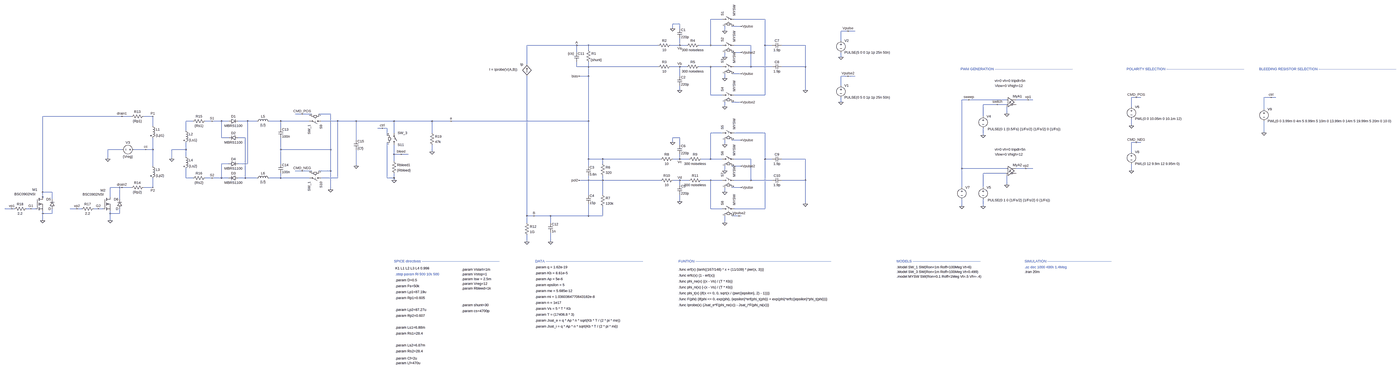
[diagram p0: schematic 7-acq_chain.asc, whole sheet]
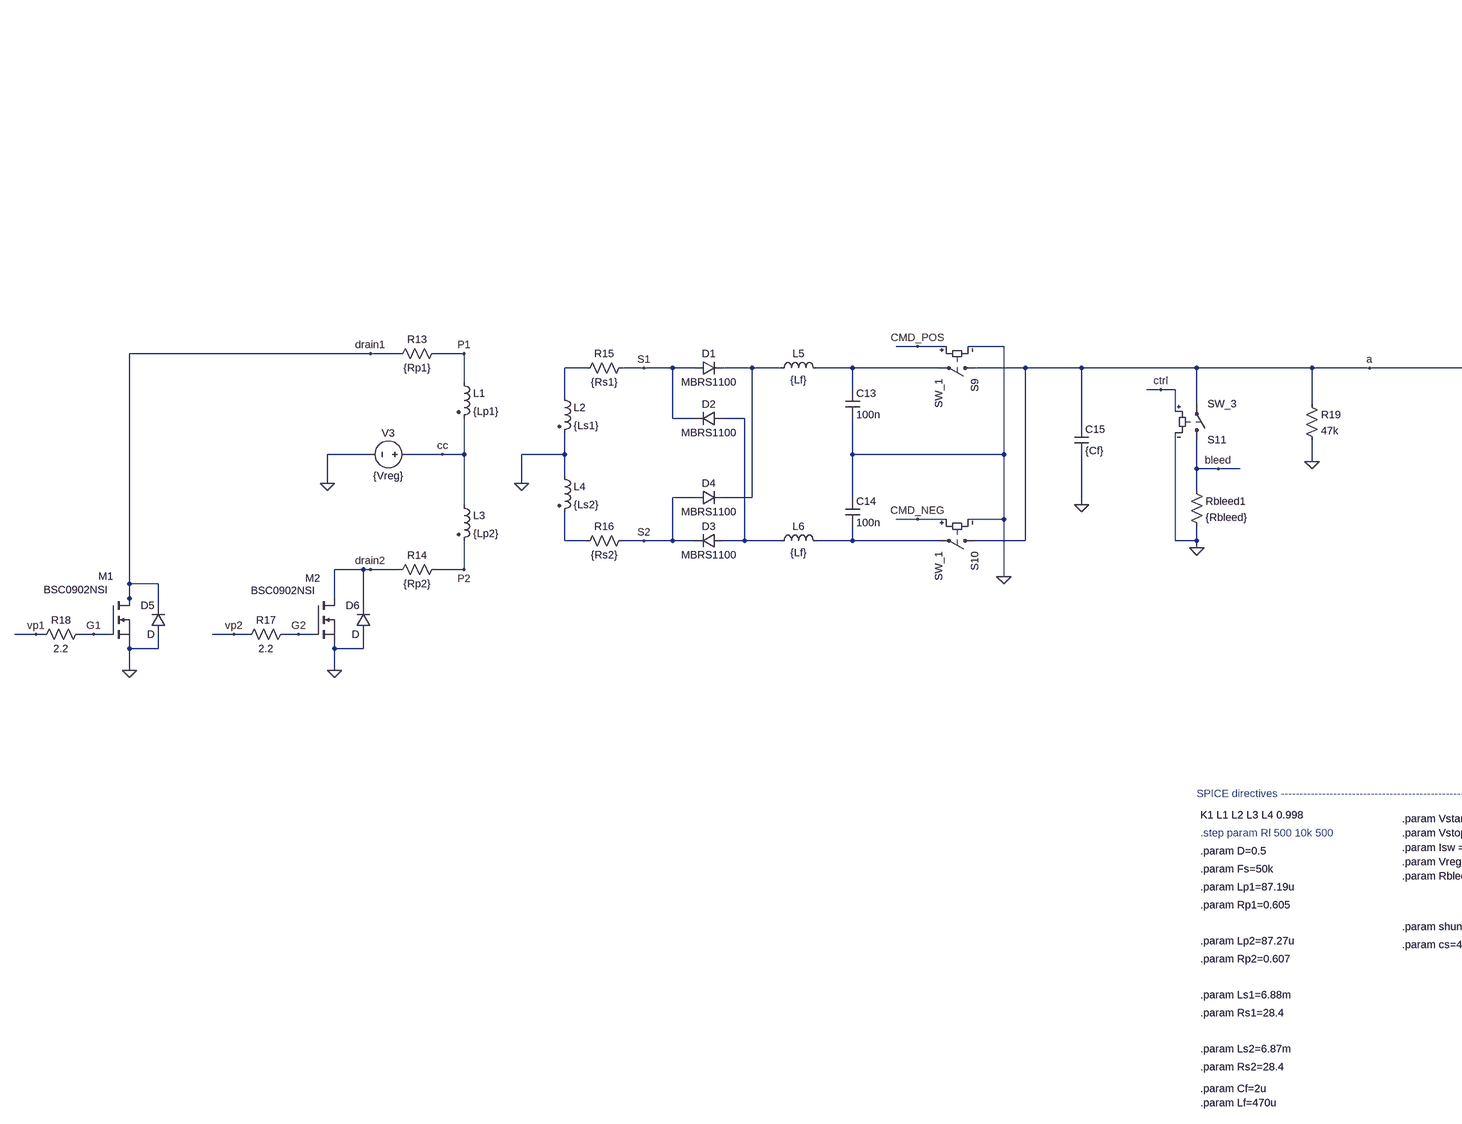
[diagram p1: schematic 7-acq_chain.asc, part, row 1 of 1, column 1 of 3]
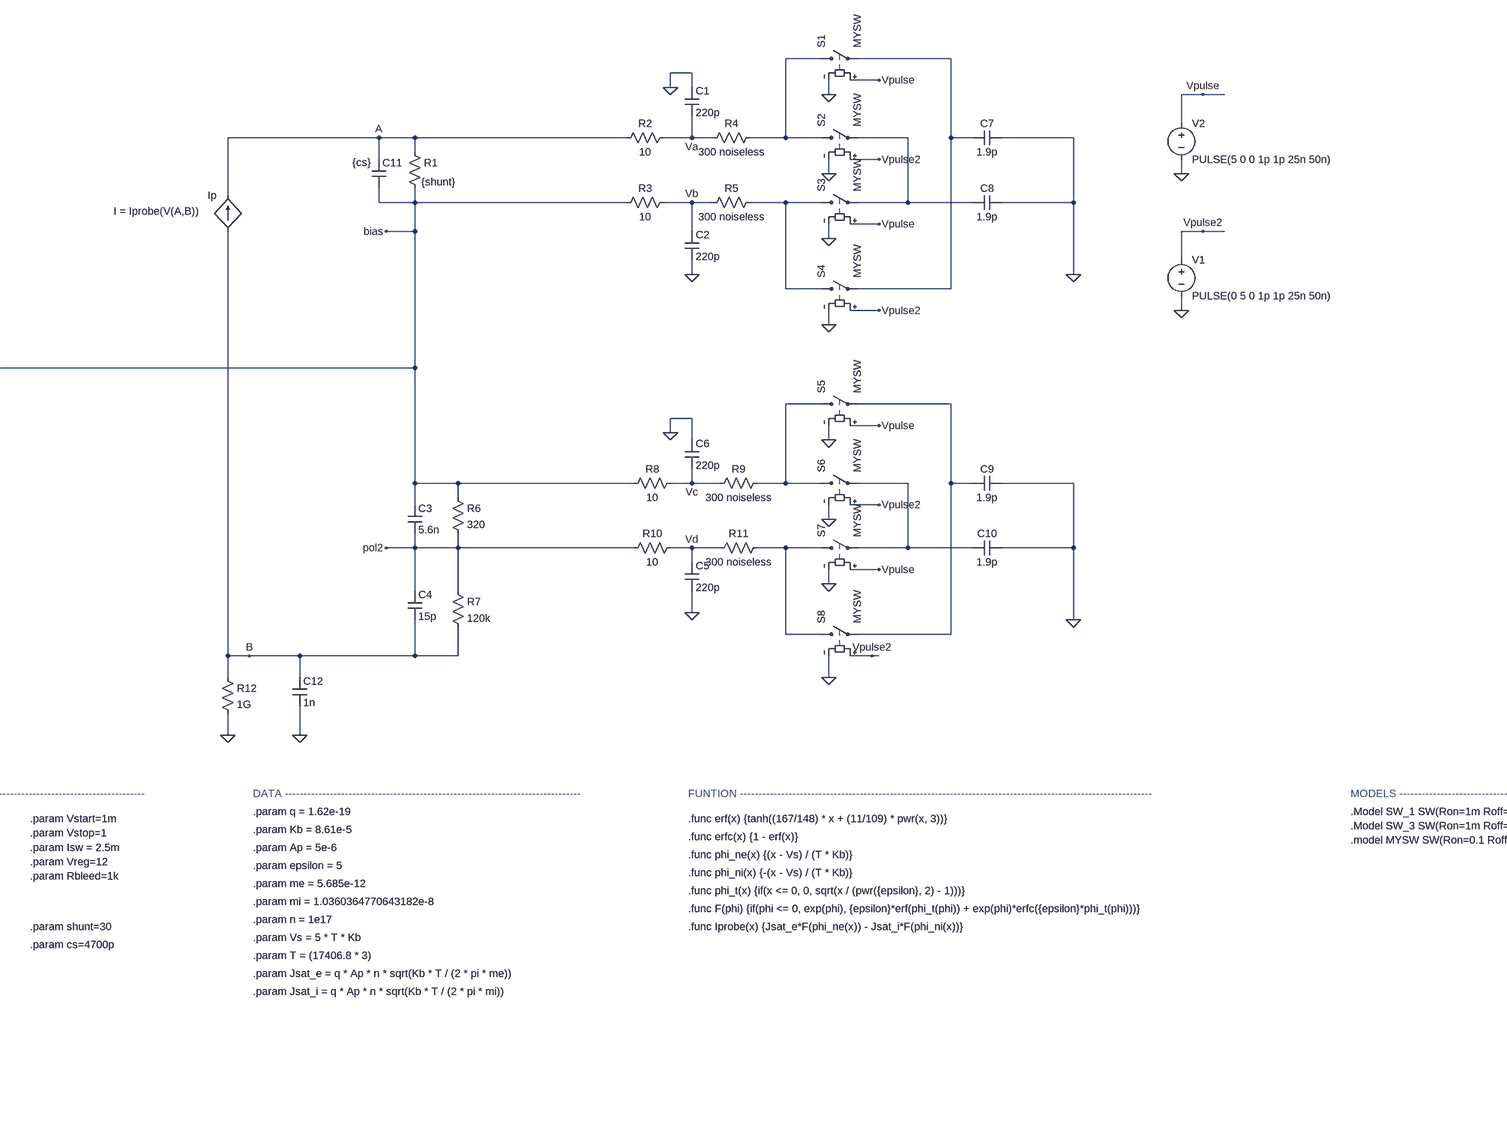
[diagram p2: schematic 7-acq_chain.asc, part, row 1 of 1, column 2 of 3]
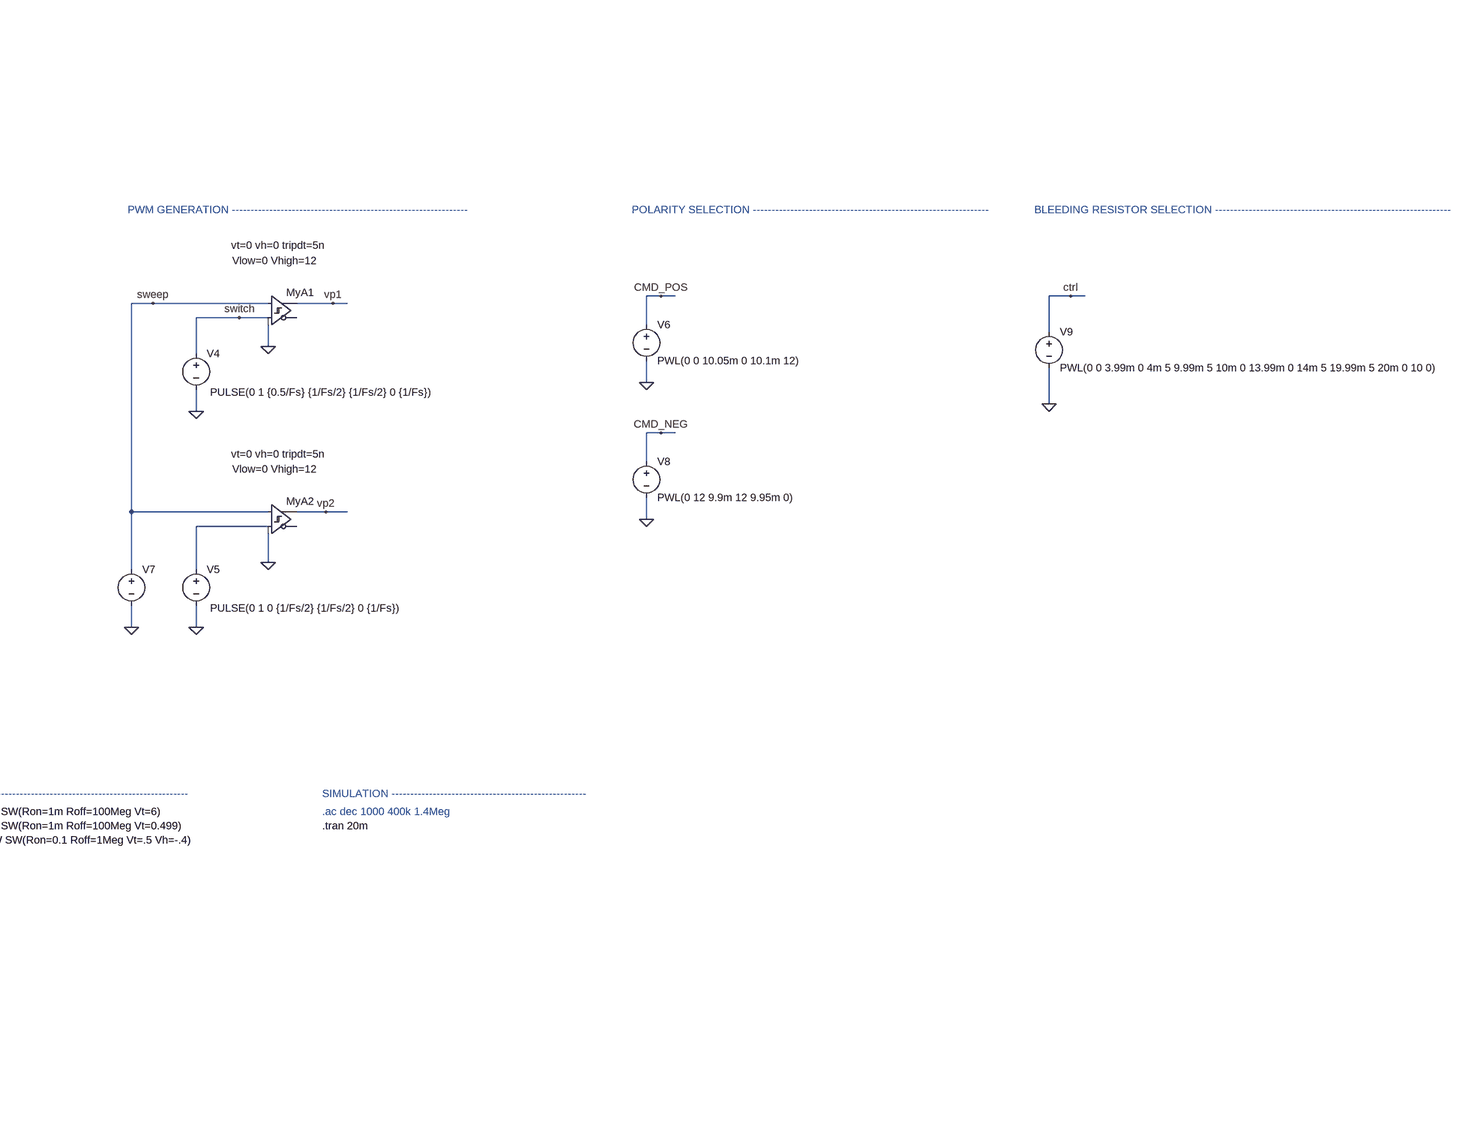
[diagram p3: schematic 7-acq_chain.asc, part, row 1 of 1, column 3 of 3]
7-acq_chain.asc, the LTspice schematic file:
Version 4.1
SHEET 1 5804 2904
WIRE 864 -304 784 -304
WIRE 1152 -304 944 -304
WIRE 576 -272 528 -272
WIRE 992 -256 928 -256
WIRE 528 -240 528 -272
WIRE 576 -240 576 -272
WIRE 880 -224 880 -256
WIRE 1712 -224 1664 -224
WIRE 1760 -224 1712 -224
WIRE 1664 -160 1664 -224
WIRE -160 -128 -496 -128
WIRE -80 -128 -160 -128
WIRE 432 -128 -80 -128
WIRE 576 -128 576 -176
WIRE 576 -128 512 -128
WIRE 624 -128 576 -128
WIRE 784 -128 784 -304
WIRE 784 -128 704 -128
WIRE 864 -128 784 -128
WIRE 1056 -128 944 -128
WIRE 1152 -128 1152 -304
WIRE 1200 -128 1152 -128
WIRE 1424 -128 1264 -128
WIRE -80 -96 -80 -128
WIRE -160 -80 -160 -128
WIRE 992 -80 928 -80
WIRE 880 -48 880 -80
WIRE 1664 -48 1664 -80
WIRE -496 0 -496 -128
WIRE -160 16 -160 -16
WIRE -80 16 -80 -16
WIRE -80 16 -160 16
WIRE 432 16 -80 16
WIRE 576 16 512 16
WIRE 624 16 576 16
WIRE 784 16 704 16
WIRE 864 16 784 16
WIRE 1056 16 1056 -128
WIRE 1056 16 944 16
WIRE 1200 16 1056 16
WIRE 1424 16 1424 -128
WIRE 1424 16 1264 16
WIRE 992 64 928 64
WIRE -80 80 -80 16
WIRE -80 80 -144 80
WIRE 576 80 576 16
WIRE 1712 80 1664 80
WIRE 1760 80 1712 80
WIRE 880 96 880 64
WIRE 1664 144 1664 80
WIRE 576 176 576 144
WIRE 1424 176 1424 16
WIRE 784 208 784 16
WIRE 864 208 784 208
WIRE 1152 208 1152 -128
WIRE 1152 208 944 208
WIRE 3712 224 3680 224
WIRE 3744 224 3712 224
WIRE 4848 224 4800 224
WIRE 4880 224 4848 224
WIRE 2528 240 2480 240
WIRE 2784 240 2528 240
WIRE 2928 240 2848 240
WIRE 2960 240 2928 240
WIRE 992 256 928 256
WIRE 1664 256 1664 224
WIRE 2720 272 2624 272
WIRE 2784 272 2720 272
WIRE 880 288 880 256
WIRE 3680 288 3680 224
WIRE 4800 304 4800 224
WIRE -2048 336 -2096 336
WIRE -1984 336 -2048 336
WIRE -1856 336 -1936 336
WIRE 2784 336 2784 288
WIRE -3264 352 -3808 352
WIRE -3200 352 -3264 352
WIRE -3056 352 -3120 352
WIRE 2624 352 2624 272
WIRE -2784 384 -2832 384
WIRE -2656 384 -2704 384
WIRE -2592 384 -2656 384
WIRE -2544 384 -2592 384
WIRE -2416 384 -2480 384
WIRE -2352 384 -2416 384
WIRE -2192 384 -2272 384
WIRE -2000 384 -2192 384
WIRE -1808 384 -1920 384
WIRE -1648 384 -1808 384
WIRE -1392 384 -1648 384
WIRE -1136 384 -1392 384
WIRE -1008 384 -1136 384
WIRE -80 384 -80 80
WIRE -80 384 -1008 384
WIRE -3056 416 -3056 352
WIRE 3680 416 3680 368
WIRE -2192 432 -2192 384
WIRE -1472 432 -1504 432
WIRE -1440 432 -1472 432
WIRE -2832 448 -2832 384
WIRE -1392 464 -1392 384
WIRE -1136 464 -1136 384
WIRE 864 464 784 464
WIRE 1152 464 944 464
WIRE 4800 464 4800 384
WIRE -1440 480 -1440 432
WIRE 2624 480 2624 432
WIRE -2592 496 -2592 384
WIRE -2544 496 -2592 496
WIRE -2432 496 -2480 496
WIRE 576 496 528 496
WIRE -1648 512 -1648 384
WIRE 992 512 928 512
WIRE 528 528 528 496
WIRE 3712 528 3680 528
WIRE 3744 528 3712 528
WIRE 576 544 576 496
WIRE 880 544 880 512
WIRE -3264 576 -3360 576
WIRE -3104 576 -3184 576
WIRE -3056 576 -3056 496
WIRE -3056 576 -3104 576
WIRE -2832 576 -2832 528
WIRE -2832 576 -2928 576
WIRE -2192 576 -2192 496
WIRE -1856 576 -1856 336
WIRE -1856 576 -2192 576
WIRE -1136 592 -1136 544
WIRE 3680 592 3680 528
WIRE -1392 608 -1392 544
WIRE -1344 608 -1392 608
WIRE -1296 608 -1344 608
WIRE -2832 624 -2832 576
WIRE -3360 640 -3360 576
WIRE -2928 640 -2928 576
WIRE -80 640 -80 384
WIRE 16 640 -80 640
WIRE 448 640 16 640
WIRE 576 640 576 608
WIRE 576 640 528 640
WIRE 640 640 576 640
WIRE 784 640 784 464
WIRE 784 640 720 640
WIRE 864 640 784 640
WIRE 1056 640 944 640
WIRE 1152 640 1152 464
WIRE 1200 640 1152 640
WIRE 1424 640 1264 640
WIRE -1392 656 -1392 608
WIRE -2544 672 -2592 672
WIRE -2416 672 -2416 384
WIRE -2416 672 -2480 672
WIRE -2192 672 -2192 576
WIRE 16 672 16 640
WIRE -3056 688 -3056 576
WIRE -1648 688 -1648 576
WIRE -80 688 -80 640
WIRE 992 688 928 688
WIRE 2480 704 2480 240
WIRE 2784 704 2480 704
WIRE 2912 704 2848 704
WIRE 2960 704 2912 704
WIRE -2048 720 -2096 720
WIRE -1984 720 -2048 720
WIRE -1856 720 -1856 576
WIRE -1856 720 -1936 720
WIRE 880 720 880 688
WIRE 3680 720 3680 672
WIRE 2784 736 2624 736
WIRE -2832 768 -2832 704
WIRE -2784 768 -2832 768
WIRE -2656 768 -2704 768
WIRE -2592 768 -2592 672
WIRE -2592 768 -2656 768
WIRE -2544 768 -2592 768
WIRE -2432 768 -2432 496
WIRE -2432 768 -2480 768
WIRE -2352 768 -2432 768
WIRE -2192 768 -2192 736
WIRE -2192 768 -2272 768
WIRE -2000 768 -2192 768
WIRE -1808 768 -1808 384
WIRE -1808 768 -1920 768
WIRE -1440 768 -1440 528
WIRE -1392 768 -1392 736
WIRE -1392 768 -1440 768
WIRE -1392 784 -1392 768
WIRE -80 784 -80 752
WIRE -80 784 -144 784
WIRE 16 784 16 752
WIRE 16 784 -80 784
WIRE 448 784 16 784
WIRE 576 784 528 784
WIRE 640 784 576 784
WIRE 784 784 720 784
WIRE 864 784 784 784
WIRE 1056 784 1056 640
WIRE 1056 784 944 784
WIRE 1200 784 1056 784
WIRE 1424 784 1424 640
WIRE 1424 784 1264 784
WIRE 576 816 576 784
WIRE 2784 816 2784 752
WIRE -3280 832 -3344 832
WIRE -3264 832 -3280 832
WIRE -3200 832 -3264 832
WIRE -3056 832 -3056 768
WIRE -3056 832 -3120 832
WIRE 992 832 928 832
WIRE 2480 832 2480 704
WIRE 2624 832 2624 736
WIRE -1856 848 -1856 720
WIRE -3808 864 -3808 352
WIRE -3744 864 -3808 864
WIRE 880 864 880 832
WIRE -80 880 -80 784
WIRE 16 880 16 784
WIRE -3808 896 -3808 864
WIRE -3344 896 -3344 832
WIRE -3808 912 -3808 896
WIRE -3744 912 -3744 864
WIRE -3280 912 -3280 832
WIRE 576 928 576 880
WIRE 1424 944 1424 784
WIRE 2480 960 2480 912
WIRE 2624 960 2624 912
WIRE -4016 976 -4064 976
WIRE -4000 976 -4016 976
WIRE -3888 976 -3920 976
WIRE -3856 976 -3888 976
WIRE -3568 976 -3616 976
WIRE -3536 976 -3568 976
WIRE -3424 976 -3456 976
WIRE -3392 976 -3424 976
WIRE 784 976 784 784
WIRE 864 976 784 976
WIRE 1152 976 1152 640
WIRE 1152 976 944 976
WIRE -3808 1008 -3808 992
WIRE -3744 1008 -3744 976
WIRE -3744 1008 -3808 1008
WIRE -3344 1008 -3344 992
WIRE -3280 1008 -3280 976
WIRE -3280 1008 -3344 1008
WIRE -496 1024 -496 80
WIRE -448 1024 -496 1024
WIRE -336 1024 -448 1024
WIRE -80 1024 -80 944
WIRE -80 1024 -336 1024
WIRE 16 1024 16 960
WIRE 16 1024 -80 1024
WIRE 976 1024 928 1024
WIRE 992 1024 976 1024
WIRE -3808 1056 -3808 1008
WIRE -3344 1056 -3344 1008
WIRE -496 1072 -496 1024
WIRE -336 1072 -336 1024
WIRE 880 1072 880 1024
WIRE -496 1200 -496 1152
WIRE -336 1200 -336 1136
FLAG 576 176 0
FLAG 528 -240 0
FLAG 576 -128 Va
FLAG 576 16 Vb
FLAG -144 80 bias
FLAG 528 528 0
FLAG 576 928 0
FLAG 576 640 Vc
FLAG 576 784 Vd
FLAG 1424 176 0
FLAG 992 -256 Vpulse
FLAG 992 64 Vpulse
FLAG 880 -224 0
FLAG 880 96 0
FLAG 1424 944 0
FLAG 992 512 Vpulse
FLAG 992 832 Vpulse
FLAG 880 544 0
FLAG 880 864 0
FLAG 880 720 0
FLAG 880 1072 0
FLAG 880 -48 0
FLAG 880 288 0
FLAG 976 1024 Vpulse2
FLAG 992 688 Vpulse2
FLAG 992 -80 Vpulse2
FLAG 992 256 Vpulse2
FLAG 1664 -48 0
FLAG 1664 256 0
FLAG 1712 -224 Vpulse
FLAG 1712 80 Vpulse2
FLAG -144 784 pol2
FLAG -336 1200 0
FLAG -160 -128 A
FLAG -448 1024 B
FLAG -496 1200 0
FLAG -3056 352 P1
FLAG -3056 832 P2
FLAG -3808 1056 0
FLAG -3344 1056 0
FLAG -3360 640 0
FLAG -3264 352 drain1
FLAG -3264 832 drain2
FLAG -3888 976 G1
FLAG -3424 976 G2
FLAG -3104 576 cc
FLAG -2656 384 S1
FLAG -2656 768 S2
FLAG -4016 976 vp1
FLAG -3568 976 vp2
FLAG -1856 848 0
FLAG -2048 336 CMD_POS
FLAG -1008 384 a
FLAG -1472 432 ctrl
FLAG -1392 784 0
FLAG -2048 720 CMD_NEG
FLAG -2928 640 0
FLAG -1648 688 0
FLAG -1344 608 bleed
FLAG -1136 592 0
FLAG 2624 480 0
FLAG 2784 336 0
FLAG 2528 240 sweep
FLAG 2720 272 switch
FLAG 2928 240 vp1
FLAG 2912 704 vp2
FLAG 2784 816 0
FLAG 2624 960 0
FLAG 3680 416 0
FLAG 3712 224 CMD_POS
FLAG 2480 960 0
FLAG 4800 464 0
FLAG 4848 224 ctrl
FLAG 3680 720 0
FLAG 3712 528 CMD_NEG
SYMBOL res -96 -112 R0
WINDOW 3 30 82 Left 2
SYMATTR Value {shunt}
SYMATTR InstName R1
SYMBOL res 528 -144 R90
WINDOW 0 0 56 VBottom 2
WINDOW 3 32 56 VTop 2
SYMATTR InstName R2
SYMATTR Value 10
SYMBOL res 416 32 R270
WINDOW 0 32 56 VTop 2
WINDOW 3 0 56 VBottom 2
SYMATTR InstName R3
SYMATTR Value 10
SYMBOL res 608 -112 R270
WINDOW 0 32 56 VTop 2
WINDOW 3 0 56 VBottom 2
SYMATTR InstName R4
SYMATTR Value 300 noiseless
SYMBOL res 608 32 R270
WINDOW 0 32 56 VTop 2
WINDOW 3 0 56 VBottom 2
SYMATTR InstName R5
SYMATTR Value 300 noiseless
SYMBOL cap 560 -240 R0
SYMATTR InstName C1
SYMATTR Value 220p
SYMBOL cap 560 80 R0
SYMATTR InstName C2
SYMATTR Value 220p
SYMBOL res 0 656 R0
SYMATTR InstName R6
SYMATTR Value 320
SYMBOL res 0 864 R0
SYMATTR InstName R7
SYMATTR Value 120k
SYMBOL cap -96 688 R0
SYMATTR InstName C3
SYMATTR Value 5.6n
SYMBOL cap -96 880 R0
SYMATTR InstName C4
SYMATTR Value 15p
SYMBOL res 544 624 R90
WINDOW 0 0 56 VBottom 2
WINDOW 3 32 56 VTop 2
SYMATTR InstName R8
SYMATTR Value 10
SYMBOL res 736 624 R90
WINDOW 0 0 56 VBottom 2
WINDOW 3 32 56 VTop 2
SYMATTR InstName R9
SYMATTR Value 300 noiseless
SYMBOL res 544 768 R90
WINDOW 0 0 56 VBottom 2
WINDOW 3 32 56 VTop 2
SYMATTR InstName R10
SYMATTR Value 10
SYMBOL res 736 768 R90
WINDOW 0 0 56 VBottom 2
WINDOW 3 32 56 VTop 2
SYMATTR InstName R11
SYMATTR Value 300 noiseless
SYMBOL cap 560 816 R0
SYMATTR InstName C5
SYMATTR Value 220p
SYMBOL cap 560 544 R0
SYMATTR InstName C6
SYMATTR Value 220p
SYMBOL sw 848 -304 R270
SYMATTR InstName S1
SYMATTR Value MYSW
SYMBOL sw 848 -128 R270
SYMATTR InstName S2
SYMATTR Value MYSW
SYMBOL sw 848 16 R270
SYMATTR InstName S3
SYMATTR Value MYSW
SYMBOL sw 848 208 R270
SYMATTR InstName S4
SYMATTR Value MYSW
SYMBOL voltage 1664 128 R0
WINDOW 123 0 0 Left 0
WINDOW 39 0 0 Left 0
SYMATTR InstName V1
SYMATTR Value PULSE(0 5 0 1p 1p 25n 50n)
SYMBOL cap 1264 -144 R90
WINDOW 0 0 32 VBottom 2
WINDOW 3 32 32 VTop 2
SYMATTR InstName C7
SYMATTR Value 1.9p
SYMBOL cap 1264 0 R90
WINDOW 0 0 32 VBottom 2
WINDOW 3 32 32 VTop 2
SYMATTR InstName C8
SYMATTR Value 1.9p
SYMBOL sw 848 464 R270
SYMATTR InstName S5
SYMATTR Value MYSW
SYMBOL sw 848 640 R270
SYMATTR InstName S6
SYMATTR Value MYSW
SYMBOL sw 848 784 R270
SYMATTR InstName S7
SYMATTR Value MYSW
SYMBOL sw 848 976 R270
SYMATTR InstName S8
SYMATTR Value MYSW
SYMBOL cap 1264 624 R90
WINDOW 0 0 32 VBottom 2
WINDOW 3 32 32 VTop 2
SYMATTR InstName C9
SYMATTR Value 1.9p
SYMBOL cap 1264 768 R90
WINDOW 0 0 32 VBottom 2
WINDOW 3 32 32 VTop 2
SYMATTR InstName C10
SYMATTR Value 1.9p
SYMBOL voltage 1664 -176 R0
WINDOW 123 0 0 Left 0
WINDOW 39 0 0 Left 0
SYMATTR InstName V2
SYMATTR Value PULSE(5 0 0 1p 1p 25n 50n)
SYMBOL cap -176 -80 R0
WINDOW 3 -43 7 Left 2
SYMATTR Value {cs}
SYMATTR InstName C11
SYMBOL bi -496 80 R180
WINDOW 0 24 80 Left 2
WINDOW 3 63 45 Left 2
SYMATTR InstName Ip
SYMATTR Value I = Iprobe(V(A,B))
SYMBOL cap -352 1072 R0
SYMATTR InstName C12
SYMATTR Value 1n
SYMBOL res -512 1056 R0
SYMATTR InstName R12
SYMATTR Value 1G
SYMBOL ind2 -3072 400 R0
SYMATTR InstName L1
SYMATTR Value {Lp1}
SYMATTR Type ind
SYMBOL ind2 -2848 432 R0
SYMATTR InstName L2
SYMATTR Value {Ls1}
SYMATTR Type ind
SYMBOL ind2 -3072 672 R0
SYMATTR InstName L3
SYMATTR Value {Lp2}
SYMATTR Type ind
SYMBOL ind2 -2848 608 R0
SYMATTR InstName L4
SYMATTR Value {Ls2}
SYMATTR Type ind
SYMBOL diode -2544 400 R270
WINDOW 0 32 32 VTop 2
WINDOW 3 0 32 VBottom 2
SYMATTR InstName D1
SYMATTR Value MBRS1100
SYMBOL diode -2480 480 R90
WINDOW 0 0 32 VBottom 2
WINDOW 3 32 32 VTop 2
SYMATTR InstName D2
SYMATTR Value MBRS1100
SYMBOL diode -2480 752 R90
WINDOW 0 0 32 VBottom 2
WINDOW 3 32 32 VTop 2
SYMATTR InstName D3
SYMATTR Value MBRS1100
SYMBOL diode -2544 688 R270
WINDOW 0 32 32 VTop 2
WINDOW 3 0 32 VBottom 2
SYMATTR InstName D4
SYMATTR Value MBRS1100
SYMBOL res -3104 336 R90
WINDOW 0 0 56 VBottom 2
WINDOW 3 32 56 VTop 2
SYMATTR InstName R13
SYMATTR Value {Rp1}
SYMBOL res -3104 816 R90
WINDOW 0 0 56 VBottom 2
WINDOW 3 32 56 VTop 2
SYMATTR InstName R14
SYMATTR Value {Rp2}
SYMBOL res -2688 368 R90
WINDOW 0 0 56 VBottom 2
WINDOW 3 32 56 VTop 2
SYMATTR InstName R15
SYMATTR Value {Rs1}
SYMBOL res -2688 752 R90
WINDOW 0 0 56 VBottom 2
WINDOW 3 32 56 VTop 2
SYMATTR InstName R16
SYMATTR Value {Rs2}
SYMBOL nmos -3856 896 R0
WINDOW 0 -21 -49 Left 2
WINDOW 3 -143 -19 Left 2
SYMATTR InstName M1
SYMATTR Value BSC0902NSI
SYMBOL nmos -3392 896 R0
WINDOW 0 -17 -45 Left 2
WINDOW 3 -138 -17 Left 2
SYMATTR InstName M2
SYMATTR Value BSC0902NSI
SYMBOL res -3440 960 R90
WINDOW 0 0 56 VBottom 2
WINDOW 3 32 56 VTop 2
SYMATTR InstName R17
SYMATTR Value 2.2
SYMBOL res -3904 960 R90
WINDOW 0 0 56 VBottom 2
WINDOW 3 32 56 VTop 2
SYMATTR InstName R18
SYMATTR Value 2.2
SYMBOL diode -3728 976 R180
WINDOW 0 24 64 Left 2
WINDOW 3 24 0 Left 2
SYMATTR InstName D5
SYMBOL diode -3264 976 R180
WINDOW 0 24 64 Left 2
WINDOW 3 24 0 Left 2
SYMATTR InstName D6
SYMBOL sw -1904 384 R90
SYMATTR InstName S9
SYMATTR Value SW_1
SYMBOL sw -1904 768 R90
SYMATTR InstName S10
SYMATTR Value SW_1
SYMBOL sw -1392 560 M180
SYMATTR InstName S11
SYMATTR Value SW_3
SYMBOL res -1408 640 R0
SYMATTR InstName Rbleed1
SYMATTR Value {Rbleed}
SYMBOL res -1152 448 R0
SYMATTR InstName R19
SYMATTR Value 47k
SYMBOL ind -2368 400 R270
WINDOW 0 32 56 VTop 2
WINDOW 3 5 56 VBottom 2
SYMATTR InstName L5
SYMATTR Value {Lf}
SYMBOL ind -2368 784 R270
WINDOW 0 32 56 VTop 2
WINDOW 3 5 56 VBottom 2
SYMATTR InstName L6
SYMATTR Value {Lf}
SYMBOL cap -2208 432 R0
SYMATTR InstName C13
SYMATTR Value 100n
SYMBOL cap -2208 672 R0
SYMATTR InstName C14
SYMATTR Value 100n
SYMBOL voltage -3168 576 R90
WINDOW 0 -32 56 VBottom 2
WINDOW 3 32 56 VTop 2
SYMATTR InstName V3
SYMATTR Value {Vreg}
SYMBOL cap -1664 512 R0
SYMATTR InstName C15
SYMATTR Value {Cf}
SYMBOL voltage 2624 336 R0
WINDOW 3 31 102 Left 2
WINDOW 123 0 0 Left 0
WINDOW 39 24 46 Left 2
SYMATTR Value PULSE(0 1 {0.5/Fs} {1/Fs/2} {1/Fs/2} 0 {1/Fs})
SYMATTR InstName V4
SYMBOL Digital\\diffschmitt 2784 192 R0
WINDOW 3 -82 -81 Left 2
WINDOW 123 -80 -47 Left 2
SYMATTR Value vt=0 vh=0 tripdt=5n
SYMATTR Value2 Vlow=0 Vhigh=12
SYMATTR InstName MyA1
SYMBOL Digital\\diffschmitt 2784 656 R0
WINDOW 3 -82 -81 Left 2
WINDOW 123 -80 -47 Left 2
SYMATTR Value vt=0 vh=0 tripdt=5n
SYMATTR Value2 Vlow=0 Vhigh=12
SYMATTR InstName MyA2
SYMBOL voltage 2624 816 R0
WINDOW 3 31 102 Left 2
WINDOW 123 0 0 Left 0
WINDOW 39 24 46 Left 2
SYMATTR Value PULSE(0 1 0 {1/Fs/2} {1/Fs/2} 0 {1/Fs})
SYMATTR InstName V5
SYMBOL voltage 3680 272 R0
WINDOW 123 0 0 Left 0
WINDOW 39 0 0 Left 0
SYMATTR InstName V6
SYMATTR Value PWL(0 0 10.05m 0 10.1m 12)
SYMBOL voltage 2480 816 R0
WINDOW 123 0 0 Left 0
WINDOW 39 0 0 Left 0
WINDOW 3 24 96 Invisible 2
SYMATTR Value PWL(0 {Vstart} 3.4m {0.5*Vstop} 4m {Vstart} 10m {Vstart} 13.4m {0.5*Vstop} 14m {Vstart})
SYMATTR InstName V7
SYMBOL voltage 3680 576 R0
WINDOW 123 0 0 Left 0
WINDOW 39 0 0 Left 0
SYMATTR InstName V8
SYMATTR Value PWL(0 12 9.9m 12 9.95m 0)
SYMBOL voltage 4800 288 R0
WINDOW 123 0 0 Left 0
WINDOW 39 0 0 Left 0
SYMATTR InstName V9
SYMATTR Value PWL(0 0 3.99m 0 4m 5 9.99m 5 10m 0 13.99m 0 14m 5 19.99m 5 20m 0 10 0)
TEXT 2040 2304 Left 2 !.model MYSW SW(Ron=0.1 Roff=1Meg Vt=.5 Vh=-.4)
TEXT -1392 2200 Left 2 ;SPICE directives ---------------------------------------------------------------
TEXT 2904 2240 Left 2 ;.ac dec 1000 400k 1.4Meg
TEXT 2904 2200 Left 2 ;SIMULATION ----------------------------------------------------
TEXT 2904 2272 Left 2 !.tran 20m
TEXT -1384 2248 Left 2 !K1 L1 L2 L3 L4 0.998
TEXT -1384 2408 Left 2 !.param Lp1=87.19u
TEXT -1384 2448 Left 2 !.param Rp1=0.605
TEXT -1384 2528 Left 2 !.param Lp2=87.27u
TEXT -1384 2568 Left 2 !.param Rp2=0.607
TEXT -1384 2648 Left 2 !.param Ls1=6.88m
TEXT -1384 2688 Left 2 !.param Rs1=28.4
TEXT -1384 2768 Left 2 !.param Ls2=6.87m
TEXT -1384 2808 Left 2 !.param Rs2=28.4
TEXT -1384 2368 Left 2 !.param Fs=50k
TEXT -1384 2328 Left 2 !.param D=0.5
TEXT -1384 2288 Left 2 ;.step param Rl 500 10k 500
TEXT -1384 2888 Left 2 !.param Lf=470u
TEXT 568 2456 Left 2 !.func F(phi) {if(phi <= 0, exp(phi), {epsilon}*erf(phi_t(phi)) + exp(phi)*erfc({epsilon}*phi_t(phi)))}
TEXT 568 2256 Left 2 !.func erf(x) {tanh((167/148) * x + (11/109) * pwr(x, 3))}
TEXT 568 2200 Left 2 ;FUNTION --------------------------------------------------------------------------------------------------------------
TEXT 568 2296 Left 2 !.func erfc(x) {1 - erf(x)}
TEXT 568 2416 Left 2 !.func phi_t(x) {if(x <= 0, 0, sqrt(x / (pwr({epsilon}, 2) - 1)))}
TEXT -440 2560 Left 2 !.param T = (17406.8 * 3)
TEXT -440 2520 Left 2 !.param Vs = 5 * T * Kb
TEXT -440 2320 Left 2 !.param Ap = 5e-6
TEXT -440 2360 Left 2 !.param epsilon = 5
TEXT -440 2400 Left 2 !.param me = 5.685e-12
TEXT -440 2440 Left 2 !.param mi = 1.0360364770643182e-8
TEXT -440 2480 Left 2 !.param n = 1e17
TEXT -440 2600 Left 2 !.param Jsat_e = q * Ap * n * sqrt(Kb * T / (2 * pi * me))
TEXT -440 2640 Left 2 !.param Jsat_i = q * Ap * n * sqrt(Kb * T / (2 * pi * mi))
TEXT -440 2200 Left 2 ;DATA -------------------------------------------------------------------------------
TEXT 568 2336 Left 2 !.func phi_ne(x) {(x - Vs) / (T * Kb)}
TEXT -440 2240 Left 2 !.param q = 1.62e-19
TEXT 568 2376 Left 2 !.func phi_ni(x) {-(x - Vs) / (T * Kb)}
TEXT -440 2280 Left 2 !.param Kb = 8.61e-5
TEXT 568 2496 Left 2 !.func Iprobe(x) {Jsat_e*F(phi_ne(x)) - Jsat_i*F(phi_ni(x))}
TEXT -936 2256 Left 2 !.param Vstart=1m
TEXT -936 2288 Left 2 !.param Vstop=1
TEXT 2040 2240 Left 2 !.Model SW_1 SW(Ron=1m Roff=100Meg Vt=6)
TEXT 2040 2272 Left 2 !.Model SW_3 SW(Ron=1m Roff=100Meg Vt=0.499)
TEXT -936 2320 Left 2 !.param Isw = 2.5m
TEXT 2040 2200 Left 2 ;MODELS -------------------------------------------------------
TEXT -936 2352 Left 2 !.param Vreg=12
TEXT -936 2384 Left 2 !.param Rbleed=1k
TEXT -1384 2856 Left 2 !.param Cf=2u
TEXT 2472 32 Left 2 ;PWM GENERATION ---------------------------------------------------------------
TEXT 3648 32 Left 2 ;POLARITY SELECTION ---------------------------------------------------------------
TEXT 4768 32 Left 2 ;BLEEDING RESISTOR SELECTION ---------------------------------------------------------------
TEXT -936 2536 Left 2 !.param cs=4700p
TEXT -936 2496 Left 2 !.param shunt=30

The netlist it stands for:
* 7-acq_chain.asc
R1 A A {shunt}
R2 Va A 10
R3 A Vb 10
R4 Va N001 300 noiseless
R5 Vb N004 300 noiseless
C1 0 Va 220p
C2 Vb 0 220p
R6 A pol2 320
R7 pol2 B 120k
C3 A pol2 5.6n
C4 pol2 B 15p
R8 Vc A 10
R9 N008 Vc 300 noiseless
R10 Vd pol2 10
R11 N015 Vd 300 noiseless
C5 Vd 0 220p
C6 0 Vc 220p
S1 N001 N002 Vpulse 0 MYSW
S2 N001 N003 Vpulse2 0 MYSW
S3 N004 N003 Vpulse 0 MYSW
S4 N004 N002 Vpulse2 0 MYSW
V1 Vpulse2 0 PULSE(0 5 0 1p 1p 25n 50n)
C7 0 N002 1.9p
C8 0 N003 1.9p
S5 N008 N009 Vpulse 0 MYSW
S6 N008 N011 Vpulse2 0 MYSW
S7 N015 N011 Vpulse 0 MYSW
S8 N015 N009 Vpulse2 0 MYSW
C9 0 N009 1.9p
C10 0 N011 1.9p
V2 Vpulse 0 PULSE(5 0 0 1p 1p 25n 50n)
C11 A A {cs}
B§Ip B A I = Iprobe(V(A,B))
C12 B 0 1n
R12 B 0 1G
L1 P1 cc {Lp1}
L2 N005 0 {Ls1}
L3 cc P2 {Lp2}
L4 0 N013 {Ls2}
D1 S1 N006 MBRS1100
D2 N010 S1 MBRS1100
D3 N010 S2 MBRS1100
D4 S2 N006 MBRS1100
R13 P1 drain1 {Rp1}
R14 P2 drain2 {Rp2}
R15 S1 N005 {Rs1}
R16 S2 N013 {Rs2}
M1 drain1 G1 0 0 BSC0902NSI
M2 drain2 G2 0 0 BSC0902NSI
R17 G2 vp2 2.2
R18 G1 vp1 2.2
D5 0 drain1 D
D6 0 drain2 D
S9 A N007 CMD_POS 0 SW_1
S10 A N014 CMD_NEG 0 SW_1
S11 bleed A ctrl 0 SW_3
Rbleed1 bleed 0 {Rbleed}
R19 A 0 47k
L5 N006 N007 {Lf}
L6 N010 N014 {Lf}
C13 N007 0 100n
C14 0 N014 100n
V3 cc 0 {Vreg}
C15 A 0 {Cf}
V4 switch 0 PULSE(0 1 {0.5/Fs} {1/Fs/2} {1/Fs/2} 0 {1/Fs})
A§MyA1 sweep switch 0 0 0 0 vp1 0 SCHMITT vt=0 vh=0 tripdt=5n Vlow=0 Vhigh=12
A§MyA2 sweep N012 0 0 0 0 vp2 0 SCHMITT vt=0 vh=0 tripdt=5n Vlow=0 Vhigh=12
V5 N012 0 PULSE(0 1 0 {1/Fs/2} {1/Fs/2} 0 {1/Fs})
V6 CMD_POS 0 PWL(0 0 10.05m 0 10.1m 12)
V7 sweep 0 PWL(0 {Vstart} 3.4m {0.5*Vstop} 4m {Vstart} 10m {Vstart} 13.4m {0.5*Vstop} 14m {Vstart})
V8 CMD_NEG 0 PWL(0 12 9.9m 12 9.95m 0)
V9 ctrl 0 PWL(0 0 3.99m 0 4m 5 9.99m 5 10m 0 13.99m 0 14m 5 19.99m 5 20m 0 10 0)
.model D D
.lib standard.dio
.model NMOS NMOS
.model PMOS PMOS
.lib standard.mos
.model MYSW SW(Ron=0.1 Roff=1Meg Vt=.5 Vh=-.4)
* SPICE directives ---------------------------------------------------------------
* .ac dec 1000 400k 1.4Meg
* SIMULATION ----------------------------------------------------
.tran 20m
K1 L1 L2 L3 L4 0.998
.param Lp1=87.19u
.param Rp1=0.605
.param Lp2=87.27u
.param Rp2=0.607
.param Ls1=6.88m
.param Rs1=28.4
.param Ls2=6.87m
.param Rs2=28.4
.param Fs=50k
.param D=0.5
* .step param Rl 500 10k 500
.param Lf=470u
.func F(phi) {if(phi <= 0, exp(phi), {epsilon}*erf(phi_t(phi)) + exp(phi)*erfc({epsilon}*phi_t(phi)))}
.func erf(x) {tanh((167/148) * x + (11/109) * pwr(x, 3))}
* FUNTION --------------------------------------------------------------------------------------------------------------
.func erfc(x) {1 - erf(x)}
.func phi_t(x) {if(x <= 0, 0, sqrt(x / (pwr({epsilon}, 2) - 1)))}
.param T = (17406.8 * 3)
.param Vs = 5 * T * Kb
.param Ap = 5e-6
.param epsilon = 5
.param me = 5.685e-12
.param mi = 1.0360364770643182e-8
.param n = 1e17
.param Jsat_e = q * Ap * n * sqrt(Kb * T / (2 * pi * me))
.param Jsat_i = q * Ap * n * sqrt(Kb * T / (2 * pi * mi))
* DATA -------------------------------------------------------------------------------
.func phi_ne(x) {(x - Vs) / (T * Kb)}
.param q = 1.62e-19
.func phi_ni(x) {-(x - Vs) / (T * Kb)}
.param Kb = 8.61e-5
.func Iprobe(x) {Jsat_e*F(phi_ne(x)) - Jsat_i*F(phi_ni(x))}
.param Vstart=1m
.param Vstop=1
.Model SW_1 SW(Ron=1m Roff=100Meg Vt=6)
.Model SW_3 SW(Ron=1m Roff=100Meg Vt=0.499)
.param Isw = 2.5m
* MODELS -------------------------------------------------------
.param Vreg=12
.param Rbleed=1k
.param Cf=2u
* PWM GENERATION ---------------------------------------------------------------
* POLARITY SELECTION ---------------------------------------------------------------
* BLEEDING RESISTOR SELECTION ---------------------------------------------------------------
.param cs=4700p
.param shunt=30
.backanno
.end